# Altium schematic sheet bldc.SchDoc
size Tabloid; SheetNumber: 3; SheetTotal: 4; Page: BLDC
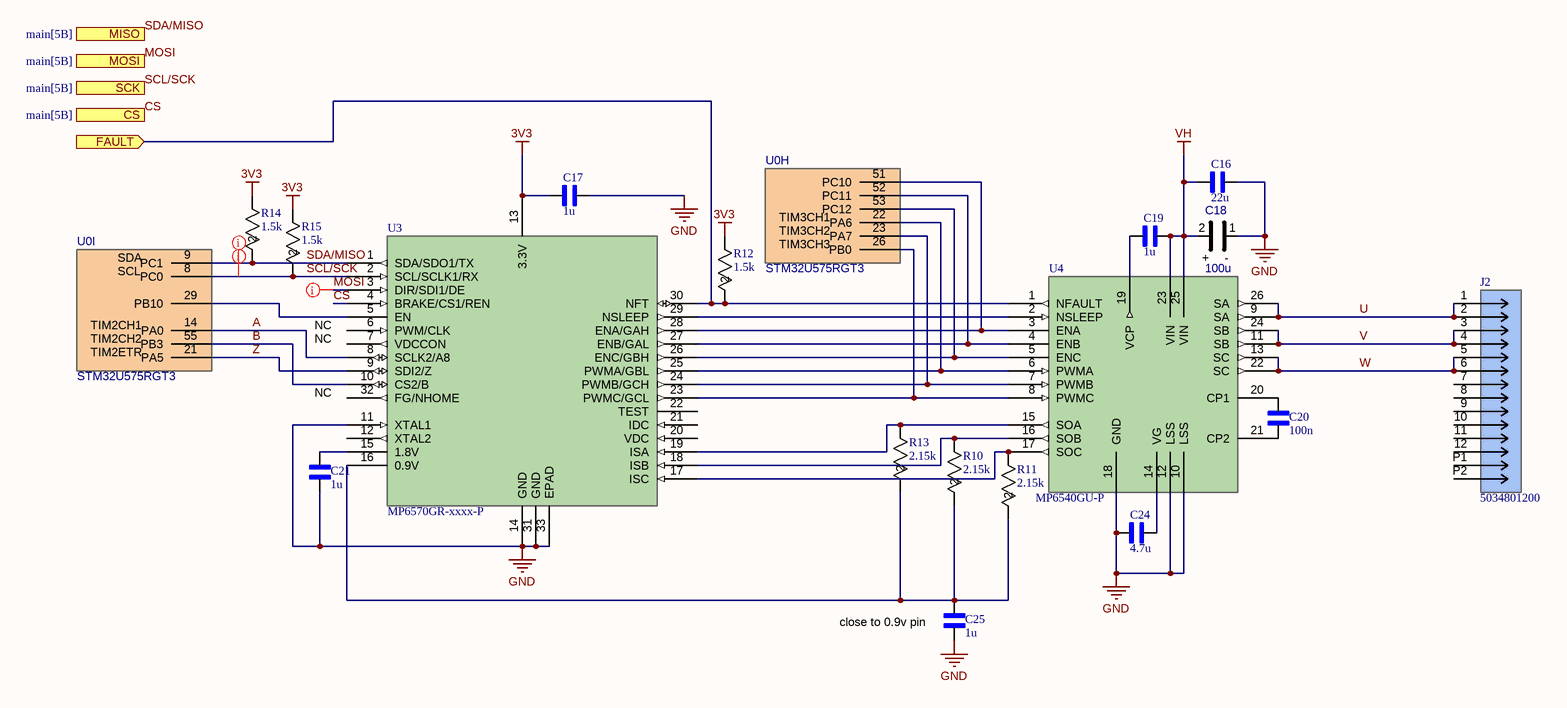
[diagram p0: bldc.SchDoc]

## Parts
C16  22u  [CAPC3225X270N]
C17  1u  [RC0603N_YAG]
C18  100u  [NICHICON63]
C19  1u  [RC0603N_YAG]
C20  100n  [CAPC1005X55N]
C21  1u  [RC0603N_YAG]
C24  4.7u  [CAPC2012X145N]
C25  1u  [RC0603N_YAG]
J2  5034801200  [CON_5034801200_MOL]
R10  2.15k  [RC0603N_YAG]
R11  2.15k  [RC0603N_YAG]
R12  1.5k  [RC0603N_YAG]
R13  2.15k  [RC0603N_YAG]
R14  1.5k  [RC0603N_YAG]
R15  1.5k  [RC0603N_YAG]
U0  STM32U575RGT3  [QFP50P1200X1200X160-64N]  (parts H,I of 10)
U3  MP6570GR-xxxx-P  [QFN-32_MP6570_MNP]
U4  MP6540GU-P  [QFN-5x5_MP6540_MNP]

## Ports
CS (in, see main[5B]), FAULT (in), MISO (in, see main[5B]), MOSI (in, see main[5B]), SCK (in, see main[5B])

## Nets
3V3: C17.2 R12.1 R14.1 R15.1 U3.13(3.3V)
GND: C16.2 C17.1 C18.1 C21.1 C24.2 C25.1 U3.11(XTAL1) U3.14(GND) U3.31(GND) U3.33(EPAD) U4.10(LSS) U4.12(LSS) U4.18(GND)
VH: C16.1 C18.2 C19.2 U4.23(VIN) U4.25(VIN)
A: U0.14(PA0) U3.8(SCLK2/A8)
B: U0.55(PB3) U3.10(CS2/B)
CS: U3.4(BRAKE/CS1/REN) ; port CS
FAULT: R12.2 U3.30(NFT) U4.1(NFAULT) ; port FAULT
MOSI: U3.3(DIR/SDI1/DE) ; port MOSI
SCL/SCK: R15.2 U0.8(PC0) U3.2(SCL/SCLK1/RX) ; port SCK
SDA/MISO: R14.2 U0.9(PC1) U3.1(SDA/SDO1/TX) ; port MISO
U: J2.1 J2.2 U4.9(SA) U4.26(SA)
V: J2.3 J2.4 U4.11(SB) U4.24(SB)
W: J2.5 J2.6 U4.13(SC) U4.22(SC)
Z: U0.21(PA5) U3.9(SDI2/Z)
NetC19_1: C19.1 U4.19(VCP)
NetC20_1: C20.1 U4.21(CP2)
NetC20_2: C20.2 U4.20(CP1)
NetC21_2: C21.2 U3.15(1.8V)
NetC24_1: C24.1 U4.14(VG)
NetC25_2: C25.2 R10.2 R11.2 R13.2 U3.16(0.9V)
NetR10_1: R10.1 U3.18(ISB) U4.16(SOB)
NetR11_1: R11.1 U3.17(ISC) U4.17(SOC)
NetR13_1: R13.1 U3.19(ISA) U4.15(SOA)
NetU0_22: U0.22(PA6) U3.25(PWMA/GBL) U4.6(PWMA)
NetU0_23: U0.23(PA7) U3.24(PWMB/GCH) U4.7(PWMB)
NetU0_26: U0.26(PB0) U3.23(PWMC/GCL) U4.8(PWMC)
NetU0_29: U0.29(PB10) U3.5(EN)
NetU0_51: U0.51(PC10) U3.28(ENA/GAH) U4.3(ENA)
NetU0_52: U0.52(PC11) U3.27(ENB/GAL) U4.4(ENB)
NetU0_53: U0.53(PC12) U3.26(ENC/GBH) U4.5(ENC)
NetU3_29: U3.29(NSLEEP) U4.2(NSLEEP)

Not connected (* = marked no-connect by the designer): J2 7 8 9 10 11 12 P1 P2; U3 6(PWM/CLK) 7(VDCCON) 12(XTAL2) 20(VDC) 21(IDC) 22(TEST) 32(FG/NHOME)

## Layout directives
net class i2c3/spi1: MOSI, SCL/SCK, SDA/MISO

## Notes on the sheet
- NC
- (near C25) close to 0.9v pin
- Board
- Page
- Author
- Date:
- File:
- (in symbol STM32U575RGT3, part H) TIM3CH1; TIM3CH2; TIM3CH3
- (in symbol STM32U575RGT3, part I) SDA; SCL; TIM2CH1; TIM2CH2; TIM2ETR
- (in symbol UCM1V101MCL1GS) +; -

## Library data of the parts
C16 = MSAST32MSB7226KPNB25: CAP CER 22UF 25V X7R 1210; MF: {'manufacturer': u'Taiyo Yuden'}; Package: None; Price: None; Value: *; MP: MSAST32MSB7226KPNB25; Availability: Unavailable; Manufacturer_Part_Number: MSAST32MSB7226KPNB25
C17 C19 C21 C25 = EMK107B7105KA-T: CAP CER 1UF 16V X7R 0603; MF: {'manufacturer': u'Taiyo Yuden'}; Package: None; Price: None; Value: *; MP: EMK107B7105KA-T; Availability: Unavailable; Manufacturer_Part_Number: EMK107B7105KA-T
C18 = UCM1V101MCL1GS: 100uF 35V; Manufacturer_Part_Number: UCM1V101MCL1GS
C20 = UMK105B7104KVHF: CAP CER 0.1UF 50V X7R 0402; MF: {'manufacturer': u'Taiyo Yuden'}; Package: None; Price: None; Value: *; MP: UMK105B7104KVHF; Availability: Unavailable; Manufacturer_Part_Number: UMK105B7104KVHF
C24 = EMK212B7475KG-T: CAP CER 4.7UF 16V X7R 0805; MF: {'manufacturer': u'Taiyo Yuden'}; Package: None; Price: None; Value: *; MP: EMK212B7475KG-T; Availability: Unavailable; Manufacturer_Part_Number: EMK212B7475KG-T
J2 = 5034801200: Easy-On FFC/FPC Connector, 0.50mm Pitch, FBH1 Series, Right-Angle, Dual Contact, 1.00mm Height, 12 Circuits, Gold over Nickel Plating; Manufacturer_Name: Molex Connector Corporation; Copyright: Copyright (C) 2026 Ultra Librarian. All rights reserved.; Manufacturer_Part_Number: 5034801200; RefDes: RefDes; Type: Type
R10 R11 R13 = RT0603BRE072K15L: 2.15K OHM 0.1% 1/10W 0603; Manufacturer_Name: Yageo; Copyright: Copyright (C) 2026 Ultra Librarian. All rights reserved.; Manufacturer_Part_Number: RT0603BRE072K15L
R12 R14 R15 = RC0603FR-071K5L: 1.5K OHM 1% 1/10W 0603; Manufacturer_Name: Yageo; Copyright: Copyright (C) 2026 Ultra Librarian. All rights reserved.; Manufacturer_Part_Number: RC0603FR-071K5L
U0 = STM32U575RGT3: Ultra-low-power Arm Cortex-M33 32-bit MCU+TrustZone+FPU, 240 DMIPS, up to 2 MB Flash memory, 786 KB SRAM; Manufacturer_Name: STMicroelectronics; Geometry.Height: 1.6mm; Manufacturer_Part_Number: STM32U575RGT3; Mouser Part Number: *; Mouser Price/Stock: *; Arrow Part Number: *; Arrow Price/Stock: *; Datasheet Link: https://www.st.com/resource/en/datasheet/stm32u575ag.pdf
U3 = MP6570GR-xxxx-P: 3-Phase BLDC Controller with aHigh-Accuracy Angular Sensor; Manufacturer_Name: Monolithic Power Systems; Copyright: Copyright (C) 2026 Ultra Librarian. All rights reserved.; Manufacturer_Part_Number: MP6570GR-xxxx-P; RefDes: RefDes; Type: Type
U4 = MP6540GU-P: 35V 3A Three-Phase Power Stage; Manufacturer_Name: Monolithic Power Systems; Copyright: Copyright (C) 2025 Ultra Librarian. All rights reserved.; Manufacturer_Part_Number: MP6540GU-P; RefDes: RefDes; Type: Type